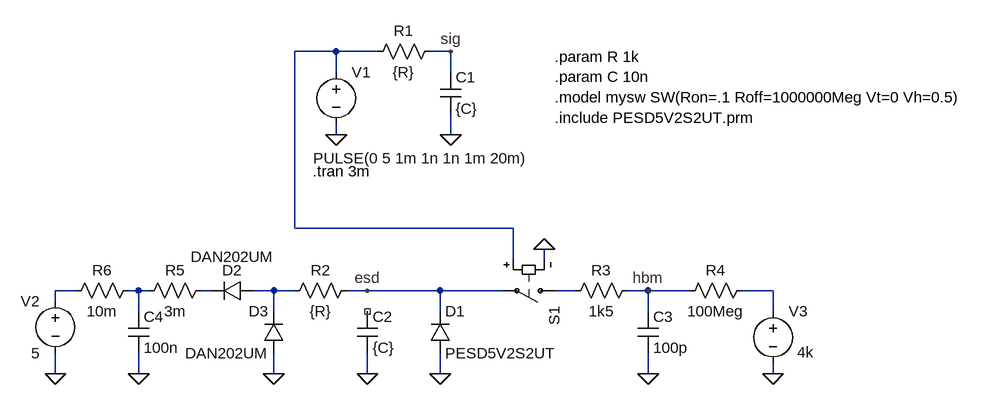
[diagram p0: schematic servo_ESD.asc]
servo_ESD.asc, the LTspice schematic file:
Version 4
SHEET 1 1164 680
WIRE 96 64 32 64
WIRE 160 64 96 64
WIRE 272 64 240 64
WIRE 96 96 96 64
WIRE 272 96 272 64
WIRE 96 192 96 176
WIRE 272 192 272 160
WIRE 32 336 32 64
WIRE 368 336 32 336
WIRE 368 384 368 336
WIRE 416 384 416 368
WIRE -304 432 -336 432
WIRE -208 432 -224 432
WIRE -192 432 -208 432
WIRE -96 432 -112 432
WIRE 0 432 -32 432
WIRE 32 432 0 432
WIRE 144 432 112 432
WIRE 256 432 144 432
WIRE 352 432 256 432
WIRE 464 432 432 432
WIRE 576 432 544 432
WIRE 640 432 576 432
WIRE 768 432 720 432
WIRE -336 448 -336 432
WIRE -208 464 -208 432
WIRE 0 464 0 432
WIRE 256 464 256 432
WIRE 576 464 576 432
WIRE 768 464 768 432
WIRE -336 560 -336 528
WIRE -208 560 -208 528
WIRE 0 560 0 528
WIRE 144 560 144 528
WIRE 256 560 256 528
WIRE 576 560 576 528
WIRE 768 560 768 544
FLAG 96 192 0
FLAG 272 192 0
FLAG 272 64 sig
FLAG 144 560 0
FLAG 144 432 esd
FLAG 576 560 0
FLAG 576 432 hbm
FLAG 768 560 0
FLAG 416 368 0
FLAG -336 560 0
FLAG -208 560 0
FLAG 256 560 0
FLAG 0 560 0
SYMBOL voltage 96 80 R0
WINDOW 3 -35 148 Left 2
WINDOW 123 0 0 Left 2
WINDOW 39 0 0 Left 2
SYMATTR InstName V1
SYMATTR Value PULSE(0 5 1m 1n 1n 1m 20m)
SYMBOL res 144 80 R270
WINDOW 0 32 56 VTop 2
WINDOW 3 0 56 VBottom 2
SYMATTR InstName R1
SYMATTR Value {R}
SYMBOL cap 256 96 R0
SYMATTR InstName C1
SYMATTR Value {C}
SYMBOL res 16 448 R270
WINDOW 0 32 56 VTop 2
WINDOW 3 0 56 VBottom 2
SYMATTR InstName R2
SYMATTR Value {R}
SYMBOL cap 128 464 R0
SYMATTR InstName C2
SYMATTR Value {C}
SYMATTR SpiceLine Rser=1m
SYMBOL res 448 448 R270
WINDOW 0 32 56 VTop 2
WINDOW 3 0 56 VBottom 2
SYMATTR InstName R3
SYMATTR Value 1k5
SYMBOL cap 560 464 R0
SYMATTR InstName C3
SYMATTR Value 100p
SYMBOL res 624 448 R270
WINDOW 0 32 56 VTop 2
WINDOW 3 0 56 VBottom 2
SYMATTR InstName R4
SYMATTR Value 100Meg
SYMBOL voltage 768 448 R0
WINDOW 3 37 79 Left 2
WINDOW 123 0 0 Left 2
WINDOW 39 0 0 Left 2
SYMATTR InstName V3
SYMATTR Value 4k
SYMBOL sw 448 432 R90
SYMATTR InstName S1
SYMATTR Value ""
SYMATTR SpiceModel mysw
SYMBOL diode -32 416 R90
WINDOW 0 0 32 VBottom 2
WINDOW 3 -52 32 VTop 2
SYMATTR InstName D2
SYMATTR Value DAN202UM
SYMBOL voltage -336 432 M0
WINDOW 123 0 0 Left 2
WINDOW 39 0 0 Left 2
SYMATTR InstName V2
SYMATTR Value 5
SYMBOL cap -224 464 R0
SYMATTR InstName C4
SYMATTR Value 100n
SYMBOL res -96 416 R90
WINDOW 0 0 56 VBottom 2
WINDOW 3 32 56 VTop 2
SYMATTR InstName R5
SYMATTR Value 3m
SYMBOL res -208 416 R90
WINDOW 0 0 56 VBottom 2
WINDOW 3 32 56 VTop 2
SYMATTR InstName R6
SYMATTR Value 10m
SYMBOL diode 240 528 M180
WINDOW 0 24 64 Left 2
WINDOW 3 24 0 Left 2
SYMATTR InstName D1
SYMATTR Value PESD5V2S2UT
SYMBOL diode 16 528 R180
WINDOW 0 24 64 Left 2
WINDOW 3 24 0 Left 2
SYMATTR InstName D3
SYMATTR Value DAN202UM
TEXT 432 72 Left 2 !.param R 1k\n.param C 10n\n.model mysw SW(Ron=.1 Roff=1000000Meg Vt=0 Vh=0.5)\n.include PESD5V2S2UT.prm
TEXT 60 248 Left 2 !.tran 3m

The netlist it stands for:
* servo_ESD.asc
V1 N001 0 PULSE(0 5 1m 1n 1n 1m 20m)
R1 N001 sig {R}
C1 sig 0 {C}
R2 N005 esd {R}
C2 NC_01 0 {C} Rser=1m
R3 N006 hbm 1k5
C3 hbm 0 100p
R4 hbm N007 100Meg
V3 N007 0 4k
S1 N006 esd N001 0 mysw
D2 N005 N004 DAN202UM
V2 N002 0 5
C4 N003 0 100n
R5 N004 N003 3m
R6 N003 N002 10m
D1 0 esd PESD5V2S2UT
D3 0 N005 DAN202UM
.model D D
.lib standard.dio
.param R 1k
.param C 10n
.model mysw SW(Ron=.1 Roff=1000000Meg Vt=0 Vh=0.5)
.include PESD5V2S2UT.prm
.tran 3m
.backanno
.end